# EAGLE design circuit_r3 (EAGLE 9.4.2)
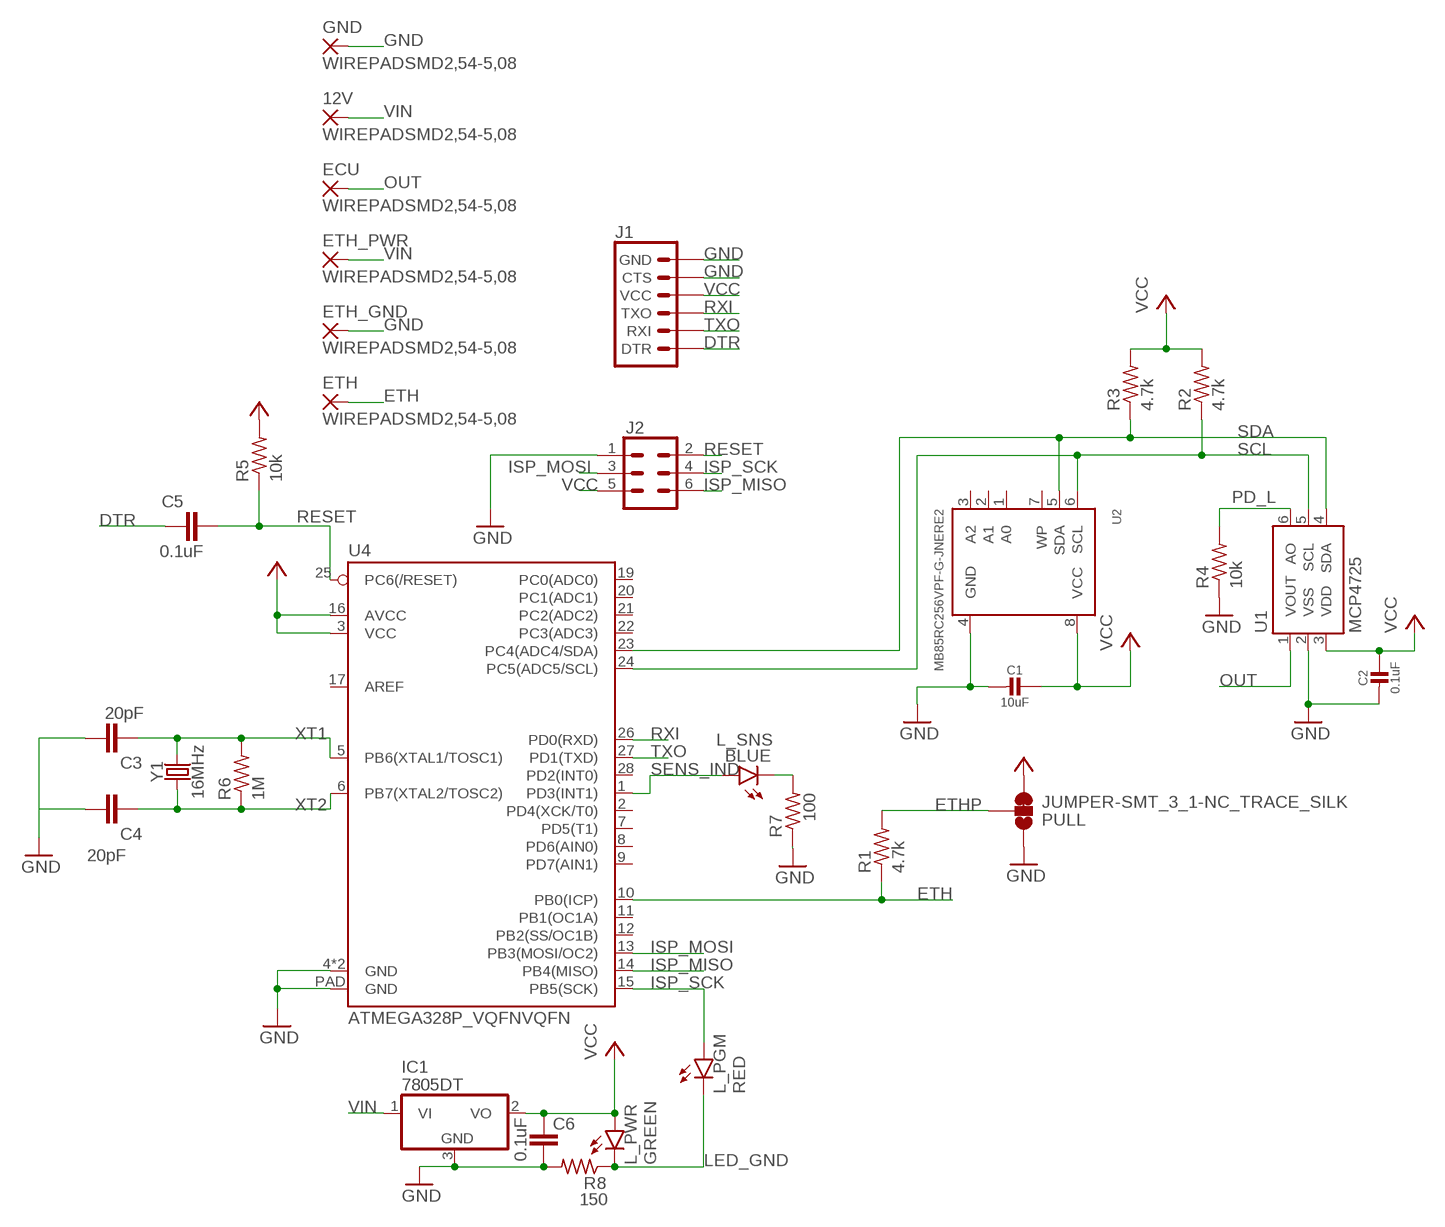
[diagram p0: schematic, sheet 1]

## Parts
12V  WIREPADSMD2,54-5,08  [SMD2,54-5,08]
C1  10uF  CAP_CERAMIC_0805  [_0805]
C2  0.1uF  CAP_CERAMIC_0603  [_0603]
C3  20pF  C  [0603]
C4  20pF  C  [0603]
C5  0.1uF  C  [0603]
C6  0.1uF  C  [0603]
ECU  WIREPADSMD2,54-5,08  [SMD2,54-5,08]
ETH  WIREPADSMD2,54-5,08  [SMD2,54-5,08]
ETH_GND  WIREPADSMD2,54-5,08  [SMD2,54-5,08]
ETH_PWR  WIREPADSMD2,54-5,08  [SMD2,54-5,08]
GND  WIREPADSMD2,54-5,08  [SMD2,54-5,08]
IC1  7805DT  [TO252]
J1  6_PIN_SERIAL_TARGETSILK  [6_PIN_SERIAL_TARGET_SIDE_W_SILK]
J2  CONN_03X22X3_SILK_MALE_PTH  [2X3]
L_PGM  RED  LED-RED0603  [LED-0603]
L_PWR  GREEN  LED-RED0603  [LED-0603]
L_SNS  BLUE  LED-RED0603  [LED-0603]
PULL  JUMPER-SMT_3_1-NC_TRACE_SILK  [SMT-JUMPER_3_1-NC_TRACE_SILK]
R1  4.7k  R-US_R0603  [R0603]
R2  4.7k  R-US_R0603  [R0603]
R3  4.7k  R-US_R0603  [R0603]
R4  10k  R-US_R0603  [R0603]
R5  10k  R-US_R0603  [R0603]
R6  1M  R-US_R0603  [R0603]
R7  100  R-US_R0603  [R0603]
R8  150  R-US_R0603  [R0603]
U1  MCP4725  MCP4725SOT-23  [SOT23-6]
U2  MB85RC256VPF-G-JNERE2  FRAM_SOIC8_I2C  [SOIC8_208MIL]
U4  ATMEGA328P_VQFNVQFN  [VQFN-28]
Y1  16MHz  CRYSTAL-16MHZSMD-5X3.2  [CRYSTAL-SMD-5X3.2-4PAD]

## Nets
DTR: C5.2 J1.P$1(DTR)
ETH: ETH.1(P) R1.1 U4.10(PB0(ICP))
ETHP: PULL.2 R1.2
GND: C1.2 C2.2 C3.1 C4.1 C6.1 ETH_GND.1(P) GND.1(P) IC1.3(GND) J1.P$5(CTS) J1.P$6(GND) J2.1 PULL.1 R4.1 R7.1 R8.2 U1.2(VSS) U2.4(GND) U4.4(GND) U4.18(GND) U4.PAD(GND)
ISP_MISO: J2.6 U4.14(PB4(MISO))
ISP_MOSI: J2.3 U4.13(PB3(MOSI/OC2))
ISP_SCK: J2.4 L_PGM.A U4.15(PB5(SCK))
LED_GND: L_PGM.C L_PWR.C R8.1
N$2: L_SNS.C R7.2
OUT: ECU.1(P) U1.1(VOUT)
PD_L: R4.2 U1.6(AO)
RESET: C5.1 J2.2 R5.1 U4.25(PC6(/RESET))
RXI: J1.P$2(TXO) U4.26(PD0(RXD))
SCL: R2.1 U1.5(SCL) U2.6(SCL) U4.24(PC5(ADC5/SCL))
SDA: R3.1 U1.4(SDA) U2.5(SDA) U4.23(PC4(ADC4/SDA))
SENS_IND: L_SNS.A U4.1(PD3(INT1))
TXO: J1.P$3(RXI) U4.27(PD1(TXD))
VCC: C1.1 C2.1 C6.2 IC1.2(VO) J1.P$4(VCC) J2.5 L_PWR.A PULL.3 R2.2 R3.2 R5.2 U1.3(VDD) U2.8(VCC) U4.3(VCC) U4.16(AVCC)
VIN: 12V.1(P) ETH_PWR.1(P) IC1.1(VI)
XT1: C3.2 R6.2 U4.5(PB6(XTAL1/TOSC1)) Y1.3
XT2: C4.2 R6.1 U4.6(PB7(XTAL2/TOSC2)) Y1.1
Unconnected: U2.1(A0) U2.2(A1) U2.3(A2) U2.7(WP) U4.2(PD4(XCK/T0)) U4.7(PD5(T1)) U4.8(PD6(AIN0)) U4.9(PD7(AIN1)) U4.11(PB1(OC1A)) U4.12(PB2(SS/OC1B)) U4.17(AREF) U4.19(PC0(ADC0)) U4.20(PC1(ADC1)) U4.21(PC2(ADC2)) U4.22(PC3(ADC3)) U4.28(PD2(INT0))

## Library data of the parts
12V ECU ETH ETH_GND ETH_PWR GND = wirepad:WIREPAD: Wire PAD connect wire on PCB
C1 C2 = microbuilder:CAP_CERAMIC: Ceramic Capacitors For new designs, use the packages preceded by an '_' character since they are more reliable: The following footprints should be used on most boards: _0402 - Standard footprint for regular board layouts _0603 - Standard footprint for regular board layouts _0805 - Standard footprint for regular board layouts _1206 - Standard footprint for regular board layouts For extremely tight-pitch boards where space is at a premium, the following 'micro-pitch' footprints can be used (smaller pads, no silkscreen outline, etc.): _0402MP - Micro-pitch footprint for very dense/compact boards _0603MP - Micro-pitch footprint for very dense/compact boards _0805MP - Micro-pitch footprint for very dense/compact boards _1206MP - Micro-pitch footprint for very dense/compact boards
C3-C6 = custom:C
IC1 = adafruit:78*: Positive VOLTAGE REGULATOR Added bigger pads to the TO-92 package
J1 = SparkFun-Connectors:6_PIN_SERIAL_TARGET: 6-pin header connection for use with the "FTDI BASIC" pinout - TARGET SIDE. Also known as "Arduino Serial Program Header". It is used to mate with our FTDI Basic serial programmers using the Arduino IDE. Note, this device has "TARGET" in the name. It is intended to be used on a design that contains a target micro-controller that you wish to program. The "sister" device, named "CABLE" is inteneded to be used on a design that usually lives on the end of your USB cable and prvides the converter chip (FTDI232 or FTDI231x) to commnicate serial RX/TX. You can populate with some of these: Break Away Headers - Straight <https://www.sparkfun.com/products/116> (PRT-00116) For reference (or to suit your programming needs) check out these designs: SparkFun FTDI Basic Breakout - 5V <https://www.sparkfun.com/products/9716> (DEV-09716) SparkFun FTDI Basic Breakout - 3.3V <https://www.sparkfun.com/products/9873> (DEV-09873) SparkFun FTDI SmartBasic <https://www.sparkfun.com/products/12935> (DEV-12935) SparkFun Beefy 3 - FTDI Basic Breakout <https://www.sparkfun.com/products/13746> (DEV-13746)
J2 = SparkFun-Connectors:CONN_03X2: Multi connection point. Often used as Generic Header-pin footprint for 0.1 inch spaced/style header connections You can populate with any combo of single row headers, but if you'd like an exact match, check these: Header - 2x3 (Male, 0.1") <https://www.sparkfun.com/products/12807> (PRT-12807) Header - 2x3 (Female, 0.1") <https://www.sparkfun.com/products/13010> (PRT-13010) 2x3 Pin Shrouded Header <https://www.sparkfun.com/products/10877> (PRT-10877) On any of the 0.1 inch spaced packages, you can populate with these: Break Away Headers - Straight <https://www.sparkfun.com/products/116> (PRT-00116) Break Away Male Headers - Right Angle <https://www.sparkfun.com/products/553> (PRT-00553) Female Headers <https://www.sparkfun.com/products/115> (PRT-00115) Break Away Headers - Machine Pin <https://www.sparkfun.com/products/117> (PRT-00117) Break Away Female Headers - Swiss Machine Pin <https://www.sparkfun.com/products/743> (PRT-00743) Special note: the shrouded connector mates well with our 3x2 ribbon cables: Ribbon Crimp Connector - 6-pin (2x3, Female) <https://www.sparkfun.com/products/10651> (PRT-10651) Ribbon Cable - 6 wire (15ft) <https://www.sparkfun.com/products/10646> (PRT-10646); PROD_ID: CONN-09701
L_PGM = SparkFun-LED:LED-RED: Red SMD LED Used in manufacturing of most products at SparkFun Packages: 0603 - SMD 0603 package [Product Link] <http://docs.avagotech.com/docs/AV02-0551EN> 0603 SMART - SMD 0603 SMART package ( more efficient and expensive)[Product Link] <http://www.osram-os.com/Graphics/XPic2/00077099_0.pdf> 1206 - SMD1206 package [Product Link] <https://www.sparkfun.com/datasheets/DevTools/LilyPad/Q150OVS4.pdff> SparkFun Products: Pro Mini 328 -5V <https://www.sparkfun.com/products/821> RedBoard <https://www.sparkfun.com/products/12757> IOIO-OTG <https://www.sparkfun.com/products/13613>; PROD_ID: DIO-00819
L_PWR L_SNS = SparkFun-LED:LED-RED: Red SMD LED Used in manufacturing of most products at SparkFun Packages: 0603 - SMD 0603 package [Product Link] <http://docs.avagotech.com/docs/AV02-0551EN> 0603 SMART - SMD 0603 SMART package ( more efficient and expensive)[Product Link] <http://www.osram-os.com/Graphics/XPic2/00077099_0.pdf> 1206 - SMD1206 package [Product Link] <https://www.sparkfun.com/datasheets/DevTools/LilyPad/Q150OVS4.pdff> SparkFun Products: Pro Mini 328 -5V <https://www.sparkfun.com/products/821> RedBoard <https://www.sparkfun.com/products/12757> IOIO-OTG <https://www.sparkfun.com/products/13613>; PROD_ID: DIO-00819; VALUE: RED
PULL = SparkFun-Jumpers:JUMPER-SMT_3_1-NC_TRACE: Normally closed trace jumper (1 of 2 connections) This jumper has a trace between two pads so it's normally closed (NC). The other connection is normally open (NO). Use a razor knife to open the connection. For best results follow the IPC guidelines for cutting traces: Cutout at least 0.063 mm (0.005 in). Remove all loose material to clean up the cut area. Seal the cut with an approved epoxy. Reapply solder to reclose the connection, or to close the NO connection.
R1-R8 = adafruit:R-US_: RESISTOR, American symbol
U1 = SparkFun-IC-Conversion:MCP4725: MCP4725 DAC Microchip 12-bit I2C DAC, SOT23-6 Datasheet <https://cdn.sparkfun.com/datasheets/BreakoutBoards/MCP4725_2009.pdf> SparkFun Products SparkFun I2C DAC Breakout - MCP4725 <https://www.sparkfun.com/products/12918> (BOB-12918); PROD_ID: IC-08886
U2 = microbuilder:FRAM_SOIC8_I2C: I2C FRAM - SOIC8 Package 256KBit (32Kx8) - MB85RC256VPF-G-JNERE2 - SOIC-8 200 Mil, 2.7-5.5V, -40°C-85°C
U4 = SparkFun-IC-Microcontroller:ATMEGA328P_VQFN: Atmel 328P QFN part not in catalog
Y1 = SparkFun-Clocks:CRYSTAL-16MHZ: 16MHz Crystal Digikey Example <http://www.digikey.com/product-search/en?keywords=535-9122-1-ND> Frequency: 16MHz Frequency Stability: ±50ppm Frequency Tolerance: ±20ppm Load Capacitance: 18pF SparkFun Products: Pro Micro -5V/16MHz <https://www.sparkfun.com/products/12640> SparkFun Serial Enabled LCD Kit <https://www.sparkfun.com/products/10097>; PROD_ID: XTAL-08218; SF_ID: COM-00094

## Net classes
0 default: width 0.152 mm, clearance 0.205 mm

## Board
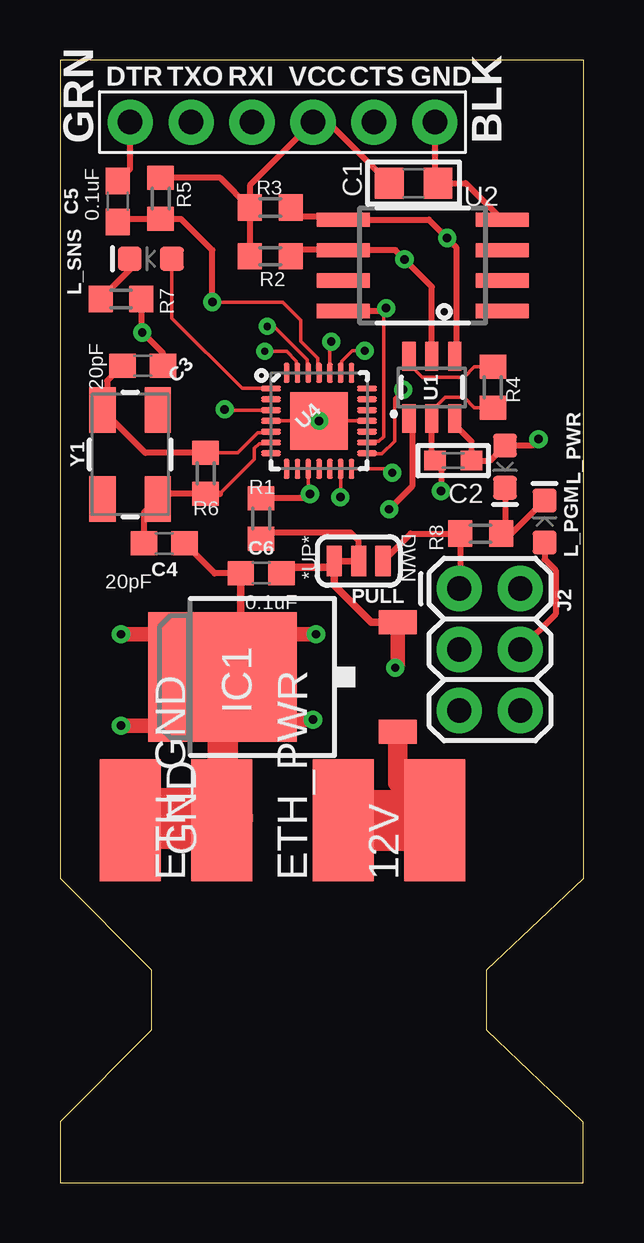
[diagram p1: board, top side]
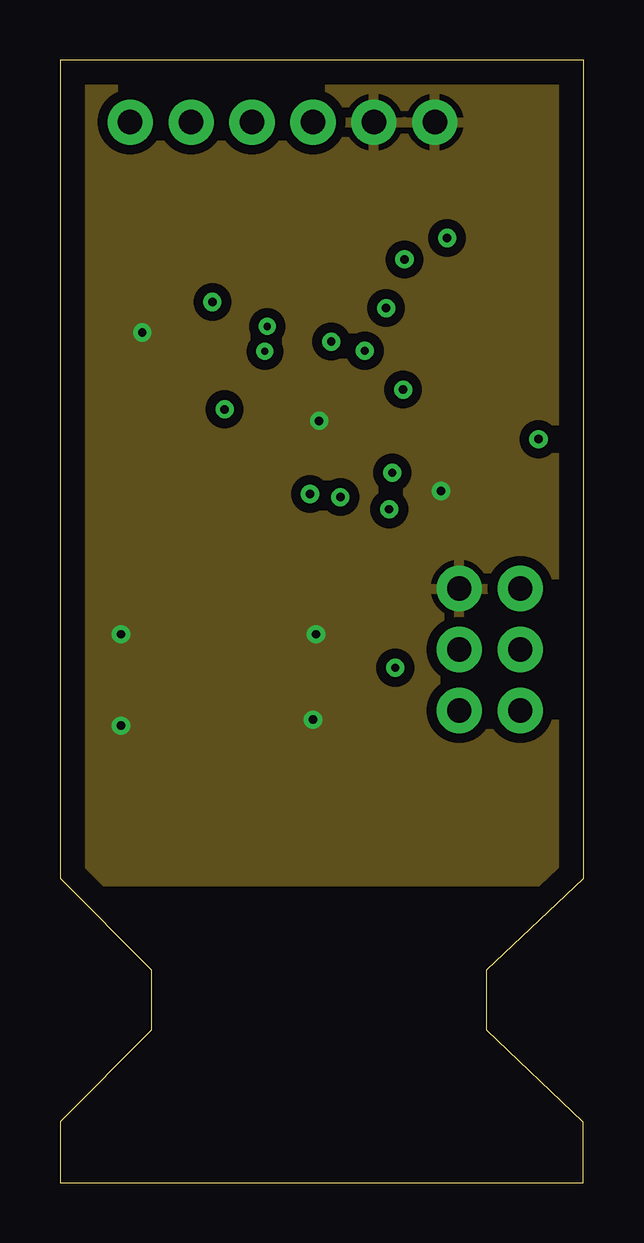
[diagram p2: board, inner layer GROUND]
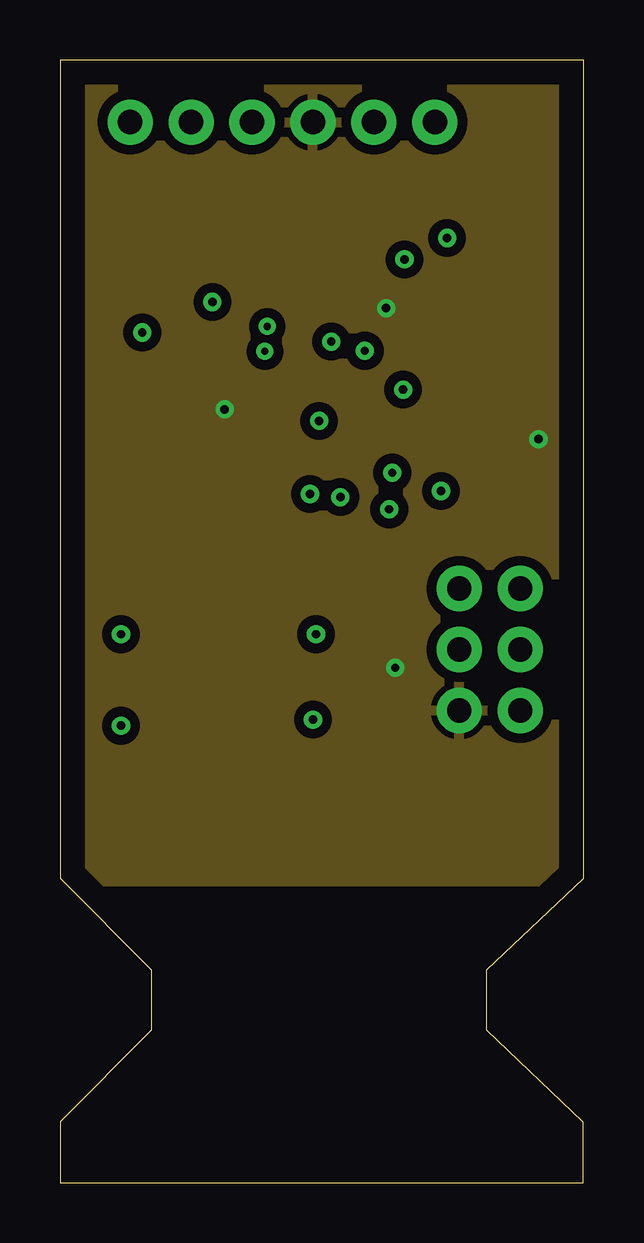
[diagram p3: board, inner layer V5]
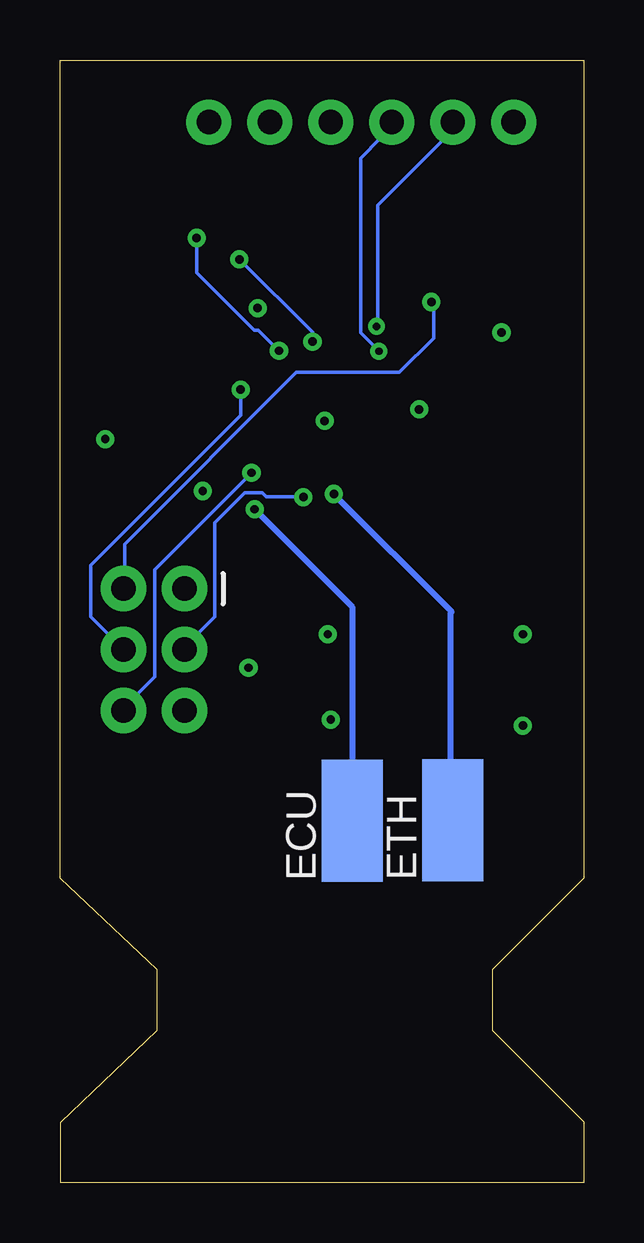
[diagram p4: board, bottom side, seen from below]

Size 21.82 x 46.79 mm. Coordinates in mm from the lower left corner, seen from the top.
Outline: 0,0 21.8,0 21.8,2.54 17.78,6.35 17.78,8.89 21.82,12.7 21.82,46.79 0,46.79 0,12.7 3.81,8.89 3.81,6.35 0,2.54 0,0
Copper layers (1+2*15+16): Top 0.035mm / dielectric 1.5mm / GROUND 0.035mm / dielectric 0.15mm / V5 0.035mm / dielectric 0.2mm / Bottom 0.035mm
Design rules "default *": minimum track width 5mil, minimum drill 10mil, track to track 5mil, track to pad 5mil, pad to pad 5mil, via to via 5mil, smd to smd 5mil, copper to edge 40mil, drill to drill 6mil, minimum pad ring 10mil, minimum via ring 8mil, stop-mask expansion 4mil, vias tented up to drill 0mil, thermal gap 10mil

### Footprints (pad centres in the part's own frame; a part is rotated, then mirrored left to right if it is on the bottom)
SMD2,54-5,08 = smd 2.54 x 5.08: 1 0,0
_0805 = smd 1.2 x 1.3: 1 -1.016,0; 2 1.016,0
_0603 = smd 0.9 x 0.8: 1 -0.762,0; 2 0.762,0
0603 = smd 1.1 x 1: 1 -0.85,0; 2 0.85,0
TO252 = smd 1 x 1.6: 1 -2.28,-4.8; 2 2.28,-4.8 | smd 5.4 x 6.2: 3 0,2.5
6_PIN_SERIAL_TARGET_SIDE_W_SILK = drill 1.016 pad 1.88: P$1 -6.35,0; P$2 -3.81,0; P$3 -1.27,0; P$4 1.27,0; P$5 3.81,0; P$6 6.35,0
2X3 = drill 1.016 pad 1.88: 1 0,0; 2 0,2.54; 3 2.54,0; 4 2.54,2.54; 5 5.08,0; 6 5.08,2.54
LED-0603 = smd 1 x 1: A -0.877,0; C 0.877,0
SMT-JUMPER_3_1-NC_TRACE_SILK = smd 0.635 x 1.27: 1 -1.016,0; 2 0,0; 3 1.016,0
R0603 = smd 1 x 1.1: 1 -0.85,0; 2 0.85,0
SOT23-6 = smd 0.55 x 1.2: 1 0.95,1.3; 2 0,1.3; 3 -0.95,1.3; 4 -0.95,-1.3; 5 0,-1.3; 6 0.95,-1.3
SOIC8_208MIL = smd 0.6 x 2.2: 1 -1.905,-3.315; 2 -0.635,-3.315; 3 0.635,-3.315; 4 1.905,-3.315; 5 1.905,3.315; 6 0.635,3.315; 7 -0.635,3.315; 8 -1.905,3.315
VQFN-28 = smd 0.82 x 0.24: 1 -0.73,2.62; 2 -0.73,2.17; 3 -0.73,1.72; 4 -0.73,1.27; 5 -0.73,0.82; 6 -0.73,0.37; 7 -0.73,-0.08; 15 3.27,-0.08; 16 3.27,0.37; 17 3.27,0.82; 18 3.27,1.27; 19 3.27,1.72; 20 3.27,2.17; 21 3.27,2.62 | smd 0.24 x 0.82: 8 -0.08,-0.73; 9 0.37,-0.73; 10 0.82,-0.73; 11 1.27,-0.73; 12 1.72,-0.73; 13 2.17,-0.73; 14 2.62,-0.73; 22 2.62,3.27; 23 2.17,3.27; 24 1.72,3.27; 25 1.27,3.27; 26 0.82,3.27; 27 0.37,3.27; 28 -0.08,3.27 | smd 2.4 x 2.4: PAD 1.27,1.27
CRYSTAL-SMD-5X3.2-4PAD = smd 1.9 x 1.1: 1 -1.85,-1.15; 2 1.85,-1.15; 3 1.85,1.15; 4 -1.85,1.15

### Placement (x,y rotation side)
12V  15.62,15.11 0 top
C1  14.73,41.66 0 top
C2  16.38,30.1 180 top
C3  3.45,34.05 180 top
C4  4.35,26.64 180 top
C5  2.41,40.89 90 top
C6  8.38,25.4 0 top
ECU  9.65,15.09 0 bottom
ETH  5.46,15.11 0 bottom
ETH_GND  6.73,15.11 0 top
ETH_PWR  11.81,15.11 0 top
GND  2.92,15.11 180 top
IC1  9.27,21.08 90 top
J1  9.27,44.2 0 top
J2  16.64,24.77 270 top
L_PGM  20.19,27.56 90 top
L_PWR  18.54,29.84 270 top
L_SNS  3.78,38.51 180 top
PULL  12.45,25.91 180 top
R1  8.38,27.69 270 top
R2  8.76,38.61 180 top
R3  8.76,40.64 180 top
R4  18.03,33.15 90 top
R5  4.19,41.02 90 top
R6  6.07,29.56 90 top
R7  2.54,36.83 180 top
R8  17.53,27.05 180 top
U1  15.49,33.15 180 top
U2  15.11,38.23 90 top
U4  9.53,30.48 0 top
Y1  2.92,30.35 90 top

### Tracks (layer width: path | path; a pad name or v marks a point on that pad's centre or on a via)
DTR
  Top 0.254: C5.2 2.92,42.25 J1.P$1
ETH  (via drill 0.35)
  Top 0.152: U4.10 10.34,28.77 v10.41,28.7
  Top 0.254: v10.41,28.7 10.25,28.54 R1.1
  Bottom 0.152: 5.54,23.76 5.51,23.79 | 5.54,15.18 ETH.1
  Bottom 0.254: v10.41,28.7 5.51,23.79 | 5.54,15.18 5.54,23.76
ETHP
  Top 0.152: 12.42,25.93 PULL.2
  Top 0.254: 12.42,25.93 12.42,26.77 12.11,27.09 8.64,27.09 R1.2
GND  (via drill 0.35)
  Top 0.152: U4.4 U4.PAD U4.18 | 15.88,29.84 C2.2 15.49,30.23 | U1.2 15.49,32.17 16.05,32.73 16.84,32.73 17.27,32.3 R4.1 | IC1.3 6.6,21.08 | 16.68,24.8 J2.1 | 16.42,26.8 R8.2 | 7.53,21.08 6.77,20.32
  Top 0.254: 15.88,29.84 v15.88,28.83 | 15.49,30.23 U1.2 | 18.41,40.14 U2.4 16.9,41.66 C1.2 15.43,41.97 15.62,42.16 J1.P$6 | C6.1 6.44,25.4 C4.1 5.46,26.38 | 4.04,34.05 C3.1 4.3,34.56 v3.43,35.43 3.39,35.47 R7.1 | 16.68,24.8 R8.2 14.61,27.05 PULL.1
  Top 0.305: C6.1 7.53,21.08
  Top 0.61: IC1.3 8.55,19.3 v10.54,19.3 | IC1.3 8.55,22.86 v10.67,22.86 | IC1.3 4.99,22.86 v2.54,22.86 | IC1.3 4.74,19.05 v2.54,19.05
  Top 1.27: IC1.3 6.77,20.32 6.77,15.2 | 6.64,15.2 ETH_GND.1
  Top 2.54: GND.1 3.01,15.2 6.64,15.2 6.77,15.2
  other vias: 10.79,31.75
  pour GROUND (isolate 0.406): 1.02,45.72 1.02,12.57 21.08,12.57 21.08,45.72
ISP_MISO  (via drill 0.35)
  Top 0.152: U4.14 13.68,29.75 v13.84,29.59
  Bottom 0.152: v13.84,29.59 13.94,29.48 17.87,25.55 17.87,21.08 19.12,19.83 J2.6
ISP_MOSI  (via drill 0.35)
  Top 0.152: U4.13 11.7,28.59 v11.68,28.57
  Bottom 0.152: v11.68,28.57 11.79,28.59 13.22,28.59 13.4,28.76 14.12,28.76 15.37,27.51 15.37,23.58 16.62,22.33 J2.3
ISP_SCK  (via drill 0.35)
  Top 0.152: v14.3,33.05 13.94,32.7 13.94,30.91 13.4,30.37 12.87,30.37 U4.15
  Top 0.254: L_PGM.A 20.19,25.98 20.65,25.52 20.65,23.7 J2.4
  Bottom 0.152: v14.3,33.05 14.3,31.98 20.55,25.73 20.55,23.58 19.3,22.33 J2.4
LED_GND
  Top 0.152: 18.54,27.22 R8.1 18.81,27.05
  Top 0.254: L_PWR.C 18.54,27.22 | L_PGM.C 18.81,27.05
N$2
  Top 0.254: L_SNS.C 2.91,38.05 R7.2
OUT  (via drill 0.35)
  Top 0.254: U1.1 14.67,31.72 14.67,29.02 v13.72,28.07
  Bottom 0.254: v13.72,28.07 9.65,24 ECU.1
PD_L
  Top 0.152: U1.6 14.54,34.12 15.1,33.57 16.84,33.57 17.27,34 R4.2
RESET  (via drill 0.35)
  Top 0.152: U4.25 10.75,33.8 10.75,34.35 10.03,35.06 10.03,35.94 9.27,36.7 v6.35,36.7
  Top 0.254: C5.1 2.54,40.17 R5.1 5.04,40.17 6.35,38.86 v6.35,36.7
  Bottom 0.152: J2.2 19.12,24.83 19.12,26.62 11.97,33.77 7.68,33.77 6.25,35.2 6.25,36.7 v6.35,36.7
RXI  (via drill 0.3)
  Top 0.152: U4.26 10.3,33.8 10.3,34.3 8.91,35.69 v8.64,35.69
  Bottom 0.152: v8.64,35.69 8.58,35.73 8.58,40.74 5.57,43.75 J1.P$2
SCL  (via drill 0.35)
  Top 0.152: U4.24 11.24,34.99 v11.3,35.05
  Top 0.254: R2.1 9.89,38.89 11.77,38.89 U2.6 13.97,38.86 v14.35,38.48 15.49,37.34 U1.5
  Bottom 0.152: v11.3,35.05 11.3,35.43 v14.35,38.48
SDA  (via drill 0.35)
  Top 0.152: 16.51,34.51 U1.4 | U4.23 11.74,33.8 11.74,34.24 12.17,34.67 v12.7,34.67
  Top 0.254: R3.1 9.99,40.26 11.67,40.26 U2.5 15.37,40.13 v16.13,39.37 16.51,38.99 16.51,34.51
  Bottom 0.152: v12.7,34.67 13.56,35.54 13.73,35.54 16.13,37.93 v16.13,39.37
SENS_IND
  Top 0.152: U4.1 7.59,33.1 4.66,36.03 L_SNS.A
TXO  (via drill 0.3)
  Top 0.152: U4.27 9.85,33.8 9.85,34.24 9.44,34.65 v8.53,34.65
  Bottom 0.152: v8.53,34.65 v8.53,34.66 9.29,35.43 9.29,42.7 8.45,43.54 J1.P$3
VCC  (via drill 0.35)
  Top 0.152: 13.59,36.32 v13.59,36.45 13.49,36.35 13.49,31.1 13.29,30.9 12.84,30.9 U4.16 | U4.3 6.89,32.2 | IC1.2 14.1,23.34 14.22,23.46
  Top 0.254: 13.59,36.32 U2.8 | R3.2 R2.2 | R3.2 6.68,41.87 R5.2 | 6.89,32.2 v6.86,32.23 | U1.3 16.44,31.59 17.14,30.89 C2.1 17.92,30.1 L_PWR.A 19.67,30.72 v19.94,30.99 | C1.1 11.18,44.2 J1.P$4 7.91,41.57 R3.2
  Top 0.305: C6.2 9.49,25.65 11.18,25.65 PULL.3 11.43,24.89 12.96,23.36 IC1.2
  Top 0.61: IC1.2 14.07,21.56 v13.97,21.46
  pour V5 (isolate 0.406): 1.02,45.72 1.02,12.57 21.08,12.57 21.08,45.72
VIN
  Top 0.813: 12V.1 14.07,16.66 IC1.1
  Top 2.54: ETH_PWR.1 12V.1
XT1
  Top 0.152: U4.5 8.75,31.25 8.25,31.25 7.41,30.41 R6.2
  Top 0.254: R6.2 3.56,30.41 1.96,32.01 | 1.96,32.01 Y1.3 | C3.2 1.96,33.42 1.96,32.01
XT2
  Top 0.152: U4.6 8.75,30.8 8.3,30.8 8.1,30.6 8.1,30.16 6.66,28.71
  Top 0.254: 6.66,28.71 R6.1 4.28,28.71 Y1.1 3.5,27.93 C4.2

### Text on the board
tNames: DWN | *UP*